# EAGLE design working (EAGLE 6.3)
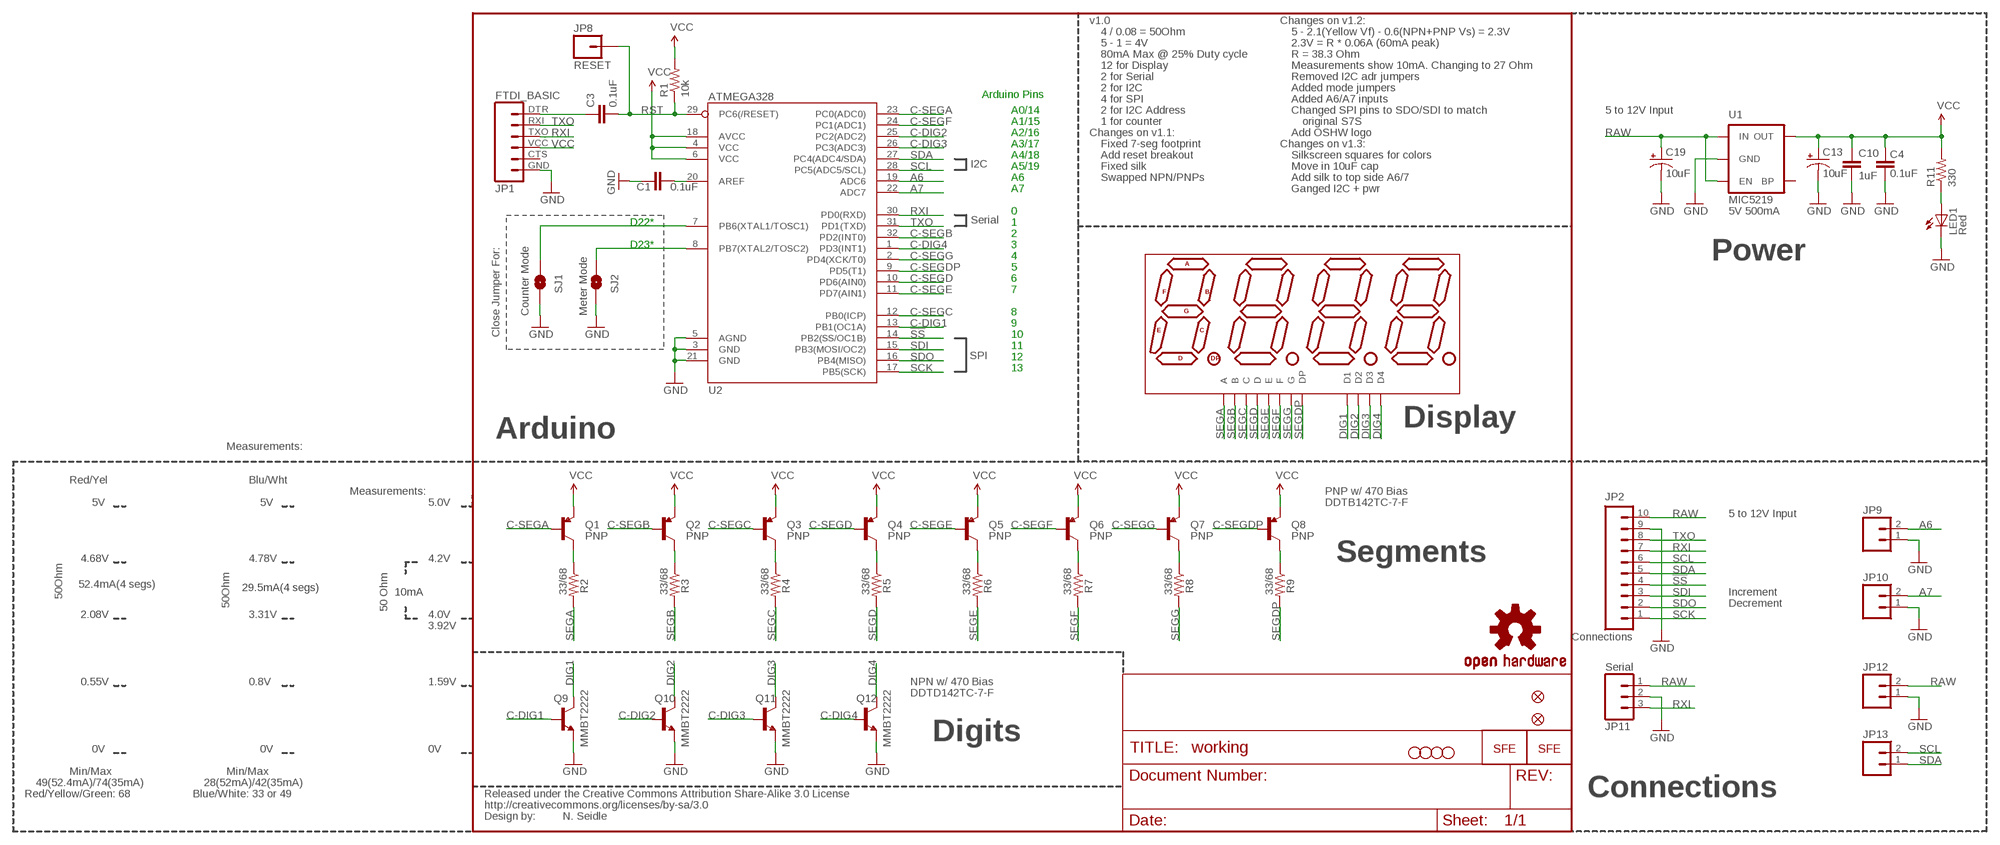
[diagram p0: schematic, sheet 1]

## Parts
C1  0.1uF  CAP0402-CAP  [0402-CAP]
C3  0.1uF  CAP0402-CAP  [0402-CAP]
C4  0.1uF  CAP0402-CAP  [0402-CAP]
C10  1uF  CAP0402-CAP  [0402-CAP]
C13  10uF  CAP_POL1206  [EIA3216]
C19  10uF  CAP_POL1206  [EIA3216]
JP1  FTDI_BASIC  FTDI_BASICPTH  [FTDI_BASIC]
JP2  Connections  M10"  [1X10]
JP3  STAND-OFF  [STAND-OFF]
JP4  STAND-OFF  [STAND-OFF]
JP5  STAND-OFF  [STAND-OFF]
JP6  STAND-OFF  [STAND-OFF]
JP7  FIDUCIALUFIDUCIAL  [MICRO-FIDUCIAL]
JP8  RESET  M01PTH  [1X01]
JP9  M02PTH  [1X02]
JP10  M02PTH  [1X02]
JP11  Serial  M03JST-PTH  [JST-3-PTH]
JP12  M02PTH  [1X02]
JP13  M02PTH  [1X02]
JP14  FIDUCIALUFIDUCIAL  [MICRO-FIDUCIAL]
LED1  Red  LED0603  [LED-0603]
Q1  PNP  TRANSISTOR_PNPSMD  [SOT23-3]
Q2  PNP  TRANSISTOR_PNPSMD  [SOT23-3]
Q3  PNP  TRANSISTOR_PNPSMD  [SOT23-3]
Q4  PNP  TRANSISTOR_PNPSMD  [SOT23-3]
Q5  PNP  TRANSISTOR_PNPSMD  [SOT23-3]
Q6  PNP  TRANSISTOR_PNPSMD  [SOT23-3]
Q7  PNP  TRANSISTOR_PNPSMD  [SOT23-3]
Q8  PNP  TRANSISTOR_PNPSMD  [SOT23-3]
Q9  MMBT2222  TRANSISTOR_NPNSOT23-3  [SOT23-3]
Q10  MMBT2222  TRANSISTOR_NPNSOT23-3  [SOT23-3]
Q11  MMBT2222  TRANSISTOR_NPNSOT23-3  [SOT23-3]
Q12  MMBT2222  TRANSISTOR_NPNSOT23-3  [SOT23-3]
R1  10k  RESISTOR0402-RES  [0402-RES]
R2  33/68  RESISTOR0402-RES  [0402-RES]
R3  33/68  RESISTOR0402-RES  [0402-RES]
R4  33/68  RESISTOR0402-RES  [0402-RES]
R5  33/68  RESISTOR0402-RES  [0402-RES]
R6  33/68  RESISTOR0402-RES  [0402-RES]
R7  33/68  RESISTOR0402-RES  [0402-RES]
R8  33/68  RESISTOR0402-RES  [0402-RES]
R9  33/68  RESISTOR0402-RES  [0402-RES]
R11  330  RESISTOR0402-RES  [0402-RES]
SJ1  Counter Ctl  SOLDERJUMPERNO  [SJ_2S-NO]
SJ2  Counter Ctl  SOLDERJUMPERNO  [SJ_2S-NO]
U1  MIC5219  V_REG_LDOSMD  [SOT23-5]
U2  ATMEGA328  ATMEGA168  [TQFP32-08]
U3  7-SEGMENT-4DIGIT-COUNTERPTH  [7-SEGMENT-4DIGIT-COUNTER]
U$2  LOGO-SFESK  [SFE-LOGO-FLAME]
U$3  CREATIVE_COMMONS  [CREATIVE_COMMONS]
U$4  OSHW-LOGOS  [OSHW-LOGO-S]
U$7  LOGO-SFENW2  [SFE-NEW-WEB]

## Nets
!SS: JP2.4 U2.14(PB2(SS/OC1B))
A6: JP9.2 U2.19(ADC6)
A7: JP10.2 U2.22(ADC7)
ANALOG: SJ2.1 U2.8(PB7(XTAL2/TOSC2))
C-DIG1: Q9.1(B) U2.13(PB1(OC1A))
C-DIG2: Q10.1(B) U2.25(PC2(ADC2))
C-DIG3: Q11.1(B) U2.26(PC3(ADC3))
C-DIG4: Q12.1(B) U2.1(PD3(INT1))
C-SEGA: Q1.1(B) U2.23(PC0(ADC0))
C-SEGB: Q2.1(B) U2.32(PD2(INT0))
C-SEGC: Q3.1(B) U2.12(PB0(ICP))
C-SEGD: Q4.1(B) U2.10(PD6(AIN0))
C-SEGDP: Q8.1(B) U2.9(PD5(T1))
C-SEGE: Q5.1(B) U2.11(PD7(AIN1))
C-SEGF: Q6.1(B) U2.24(PC1(ADC1))
C-SEGG: Q7.1(B) U2.2(PD4(XCK/T0))
COUNTER: SJ1.1 U2.7(PB6(XTAL1/TOSC1))
DIG1: Q9.3(C) U3.12(D1)
DIG2: Q10.3(C) U3.9(D2)
DIG3: Q11.3(C) U3.8(D3)
DIG4: Q12.3(C) U3.6(D4)
GND: C1.1 C4.1 C10.2 C13.C(-) C19.C(-) JP1.GND JP2.9 JP9.1 JP10.1 JP11.2 JP12.1 LED1.C Q9.2(E) Q10.2(E) Q11.2(E) Q12.2(E) SJ1.2 SJ2.2 U1.2(GND) U2.3(GND) U2.5(AGND) U2.21(GND)
N$1: Q1.3(C) R2.1
N$3: C3.1 JP1.DTR
N$4: Q2.3(C) R3.1
N$5: Q3.3(C) R4.1
N$6: Q4.3(C) R5.1
N$7: Q5.3(C) R6.1
N$8: Q6.3(C) R7.1
N$9: Q7.3(C) R8.1
N$10: Q8.3(C) R9.1
N$11: C1.2 U2.20(AREF)
N$38: LED1.A R11.1
RAW [vcc]: C19.A(+) JP2.10 JP11.1 JP12.2 U1.1(IN) U1.3(EN)
RST: C3.2 JP8.1 R1.1 U2.29(PC6(/RESET))
RXI: JP1.TXO JP2.7 JP11.3 U2.30(PD0(RXD))
SCK: JP2.1 U2.17(PB5(SCK))
SCL: JP2.6 JP13.2 U2.28(PC5(ADC5/SCL))
SDA: JP2.5 JP13.1 U2.27(PC4(ADC4/SDA))
SDI: JP2.3 U2.15(PB3(MOSI/OC2))
SDO: JP2.2 U2.16(PB4(MISO))
SEGA: R2.2 U3.11(A)
SEGB: R3.2 U3.7(B)
SEGC: R4.2 U3.4(C)
SEGD: R5.2 U3.2(D)
SEGDP: R9.2 U3.3(DP)
SEGE: R6.2 U3.1(E)
SEGF: R7.2 U3.10(F)
SEGG: R8.2 U3.5(G)
TXO: JP1.RXI JP2.8 U2.31(PD1(TXD))
VCC: C4.2 C10.1 C13.A(+) JP1.VCC Q1.2(E) Q2.2(E) Q3.2(E) Q4.2(E) Q5.2(E) Q6.2(E) Q7.2(E) Q8.2(E) R1.2 R11.2 U1.5(OUT) U2.4(VCC) U2.6(VCC) U2.18(AVCC)
Unconnected: JP1.CTS U1.4(BP)

## Notes on the sheet
- v1.0 | Changes on v1.2:
- 4 / 0.08 = 50Ohm | 5 - 2.1(Yellow Vf) - 0.6(NPN+PNP Vs) = 2.3V
- 5 - 1 = 4V | 2.3V = R * 0.06A (60mA peak)
- 80mA Max @ 25% Duty cycle | R = 38.3 Ohm
- 12 for Display | Measurements show 10mA. Changing to 27 Ohm
- 2 for Serial | Removed I2C adr jumpers
- 2 for I2C | Added mode jumpers
- Arduino Pins
- 4 for SPI | Added A6/A7 inputs
- A0/14 | 2 for I2C Address | Changed SPI pins to SDO/SDI to match | 5 to 12V Input
- A1/15 | 1 for counter | original S7S
- A2/16 | Changes on v1.1: | Add OSHW logo
- A3/17 | Fixed 7-seg footprint | Changes on v1.3:
- A4/18 | Add reset breakout | Silkscreen squares for colors
- I2C | A5/19 | Fixed silk | Move in 10uF cap
- A6 | Swapped NPN/PNPs | Add silk to top side A6/7
- A7 | Ganged I2C + pwr
- 0 | 5V 500mA
- D22* | Serial | 1
- 2
- D23* | 3
- 4 | Power
- 5
- 6
- 7
- Counter Mode | Meter Mode | 8
- 9
- Close Jumper For: | 10
- 11
- SPI | 12
- 13
- Display
- Arduino
- Measurements:
- Red/Yel | Blu/Wht
- Measurements: | PNP w/ 470 Bias
- 5V | 5V | 5.0V | DDTB142TC-7-F
- 5 to 12V Input
- 4.68V | 4.78V | 4.2V | Segments
- 52.4mA(4 segs)
- 29.5mA(4 segs)
- 10mA | Increment
- 50Ohm
- 50Ohm | Decrement
- 50 Ohm
- 2.08V | 3.31V | 4.0V
- 3.92V
- 0.55V | 0.8V | 1.59V | NPN w/ 470 Bias
- DDTD142TC-7-F
- Digits
- 0V | 0V | 0V
- Min/Max | Min/Max
- 49(52.4mA)/74(35mA) | 28(52mA)/42(35mA)
- Red/Yellow/Green: 68 | Blue/White: 33 or 49 | Connections
- N. Seidle

## Library data of the parts
C1 C3 C4 C10 = SparkFun:CAP: Capacitor Standard 0603 ceramic capacitor, and 0.1" leaded capacitor.
C13 C19 = SparkFun:CAP_POL: Capacitor Polarized These are standard SMD and PTH capacitors. Normally 10uF, 47uF, and 100uF in electrolytic and tantalum varieties. Always verify the external diameter of the through hole cap, it varies with capacity, voltage, and manufacturer. The EIA devices should be standard.
JP1 = SparkFun:FTDI_BASIC: FTDI Basic: 3.3V and 5V
JP2 = SparkFun-Connectors:M10: Header 10 Standard 10-pin 0.1" header. Use with straight break away headers (SKU : PRT-00116), right angle break away headers (PRT-00553), swiss pins (PRT-00743), machine pins (PRT-00117), and female headers (PRT-00115).
JP3-JP6 = SparkFun-Electromechanical:STAND-OFF: #4 Stand Off This is the mechanical footprint for a #4 phillips button head screw. Use the keepout ring to avoid running the screw head into surrounding components. SKU : PRT-00447
JP7 JP14 = SparkFun:FIDUCIAL: Fiducial Alignment Points Various fiducial points for machine vision alignment.
JP8 = SparkFun-Connectors:M01: Header 1 Standard 1-pin 0.1" header. Use with straight break away headers (SKU : PRT-00116), right angle break away headers (PRT-00553), swiss pins (PRT-00743), machine pins (PRT-00117), and female headers (PRT-00115).
JP9 JP10 JP12 JP13 = SparkFun-Connectors:M02: Header 2 Standard 2-pin 0.1" header. Use with straight break away headers (SKU : PRT-00116), right angle break away headers (PRT-00553), swiss pins (PRT-00743), machine pins (PRT-00117), and female headers (PRT-00115). Molex polarized connector foot print use with SKU : PRT-08233 with associated crimp pins and housings.
JP11 = SparkFun-Connectors:M03: Header 3 Standard 3-pin 0.1" header. Use with straight break away headers (SKU : PRT-00116), right angle break away headers (PRT-00553), swiss pins (PRT-00743), machine pins (PRT-00117), and female headers (PRT-00115). Molex polarized connector foot print use with SKU : PRT-08232 with associated crimp pins and housings.
LED1 = SparkFun:LED: LEDs Standard schematic elements and footprints for 5mm, 3mm, 1206, and 0603 sized LEDs. 5mm - Spark Fun Electronics SKU : COM-00529 (and others)
Q1-Q8 = SparkFun-DiscreteSemi:TRANSISTOR_PNP: Generic PNP BJT. Double check pinouts against datasheets- not all devices are the same!
Q9-Q12 = SparkFun-DiscreteSemi:TRANSISTOR_NPN: Generic NPN BJT. MMBT2222 is the common NPN we use. Double check against datasheet- not all devices are the same!
R1-R9 R11 = SparkFun:RESISTOR: Resistor Basic schematic elements and footprints for 0603, 1206, and PTH resistors.
SJ1 SJ2 = SparkFun-Passives:SOLDERJUMPER: Solder Jumper Standard SMD solder jumper. Used to automate production. Two varients : Normally Open and Normally Closed are the same, but have different paste layers. NC will have a large amount of paste and should jumper during reflow.
U1 = SparkFun:V_REG_LDO: Voltage Regulator LDO Standard 150mA LDO voltage regulator in SOT-23 layout. Micrel part MIC5205. BP (by-pass) pin is used to lower output noise with 470pF cap.
U2 = SparkFun-DigitalIC:ATMEGA168: Atmel 32-pin 8-bit micro, 16k flash.
U3 = SparkFun-Displays:7-SEGMENT-4DIGIT-COUNTER
U$2 U$7 = SparkFun:LOGO-SFE: Spark Fun Electronics PCB Logo This is the standard Spark Fun Electronics PCB logo.
U$3 = SparkFun:CREATIVE_COMMONS
U$4 = SparkFun-Aesthetics:OSHW-LOGO: Open Source Hardware Logo This logo indicates the piece of hardware it is found on incorporates a OSHW license and/or adheres to the definition of open source hardware found here: http://freedomdefined.org/OSHW

## Net classes
0 default: width 0.203 mm

## Board
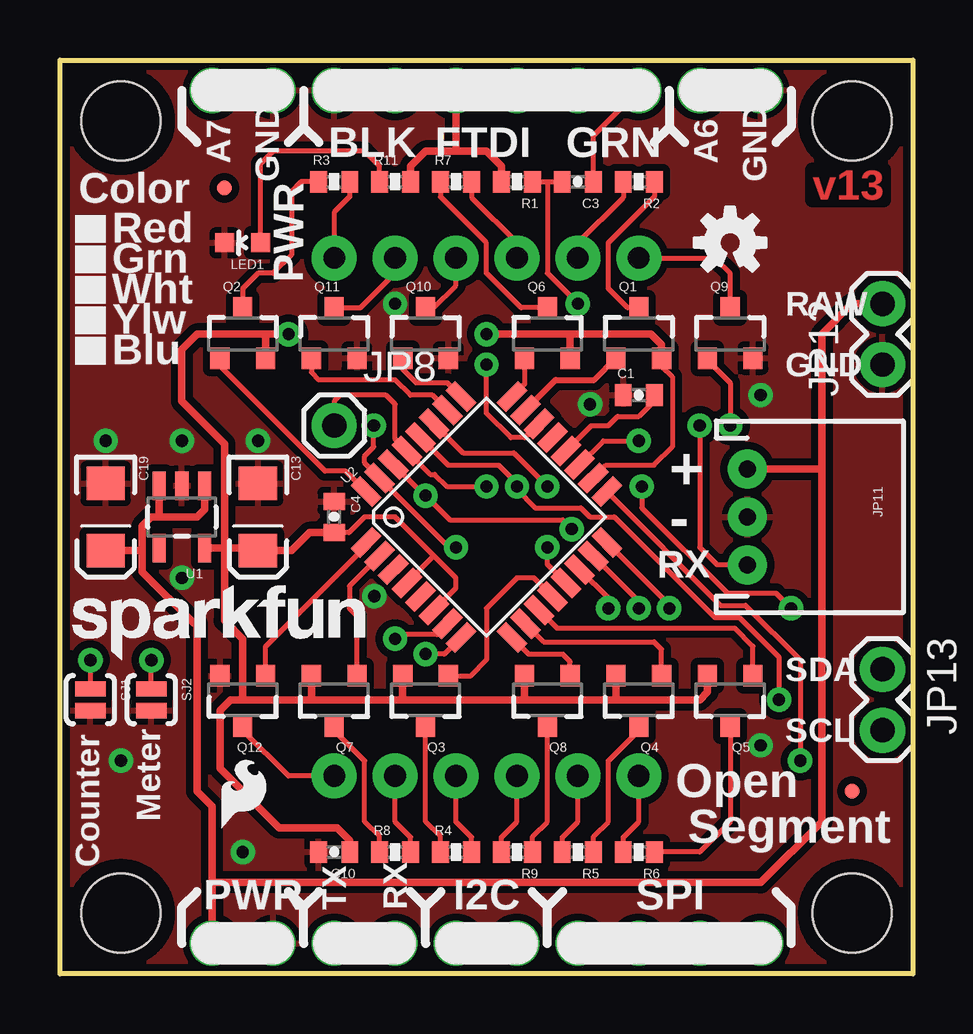
[diagram p1: board, top side]
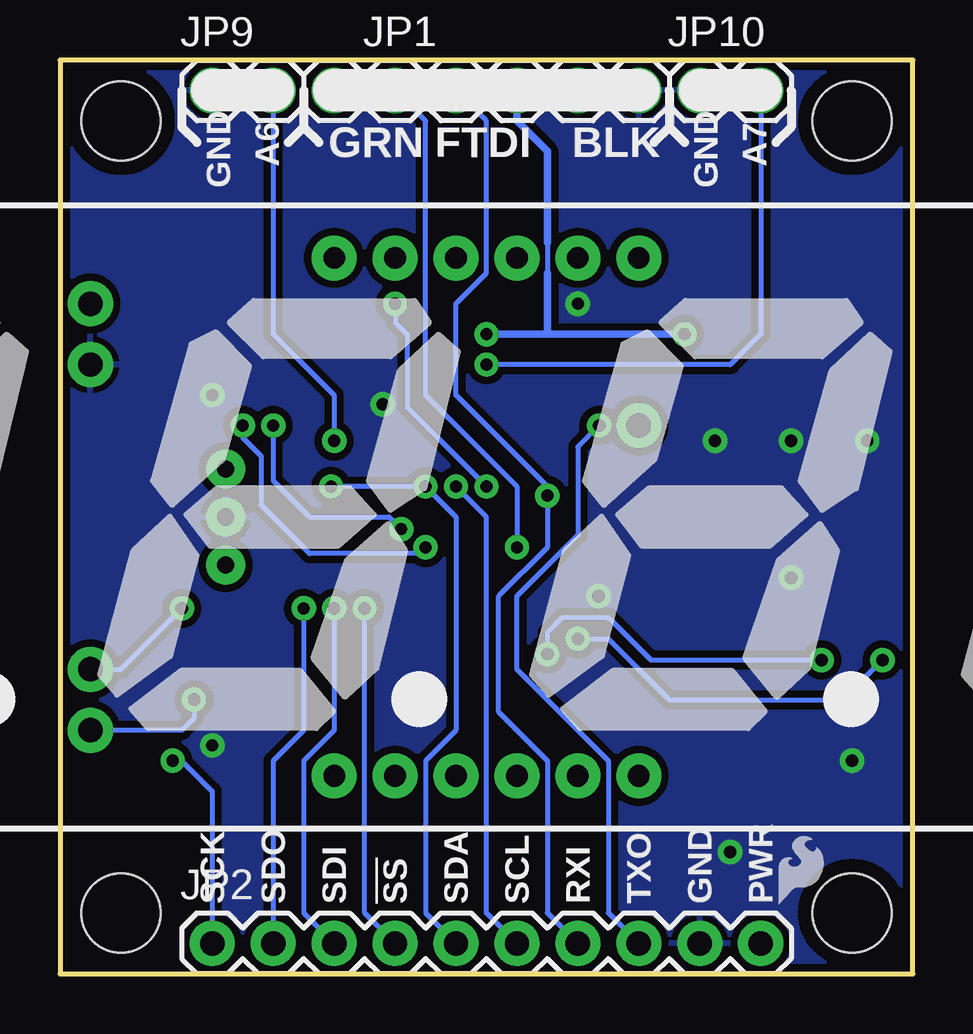
[diagram p2: board, bottom side, seen from below]

Size 35.56 x 38.1 mm. Coordinates in mm from the lower left corner, seen from the top.
Outline: 35.56,38.1 35.56,0 0,0 0,38.1 35.56,38.1
Copper layers (1*16): Top 0.035mm / dielectric 1.5mm / Bottom 0.035mm
Design rules "default": minimum track width 8mil, minimum drill 20mil, track to track 8mil, track to pad 8mil, pad to pad 8mil, via to via 8mil, smd to smd 8mil, copper to edge 10mil, drill to drill 8mil, minimum pad ring 12mil, minimum via ring 10mil, stop-mask expansion 4mil, vias tented up to drill 20mil, thermal gap 10mil

### Footprints (pad centres in the part's own frame; a part is rotated, then mirrored left to right if it is on the bottom)
0402-CAP = smd 0.7 x 0.9: 1 -0.65,0; 2 0.65,0
EIA3216 = smd 1.4 x 1.6: A 1.4,0; C -1.4,0
FTDI_BASIC = drill 1.016 pad 1.88: CTS 10.16,0; DTR 0,0; GND 12.7,0; RXI 2.54,0; TXO 5.08,0; VCC 7.62,0
1X10 = drill 1.016 pad 1.88: 1 0,0; 2 2.54,0; 3 5.08,0; 4 7.62,0; 5 10.16,0; 6 12.7,0; 7 15.24,0; 8 17.78,0; 9 20.32,0; 10 22.86,0
STAND-OFF = hole 3.302: 0,0
MICRO-FIDUCIAL = smd 0.635 x 0.635: 1 0,0
1X01 = drill 1.016 pad 1.88: 1 0,0
1X02 = drill 1.016 pad 1.88: 1 0,0; 2 2.54,0
JST-3-PTH = drill 0.7 pad 1.626: 1 -2,-5; 2 0,-5; 3 2,-5
LED-0603 = smd 0.8 x 0.8: A 0,-0.75; C 0,0.75
SOT23-3 = smd 0.8 x 0.9: 1 -0.95,-1; 2 0.95,-1; 3 0,1.1
0402-RES = smd 0.7 x 0.9: 1 -0.65,0; 2 0.65,0
SJ_2S-NO = smd 0.635 x 1.27: 1 -0.45,0; 2 0.45,0
SOT23-5 = smd 0.55 x 1.2: 1 -0.95,-1.3; 2 0,-1.3; 3 0.95,-1.3; 4 0.95,1.3; 5 -0.95,1.3
TQFP32-08 = smd 1.27 x 0.559: 1 -4.293,2.8; 2 -4.293,2; 3 -4.293,1.2; 4 -4.293,0.4; 5 -4.293,-0.4; 6 -4.293,-1.2; 7 -4.293,-2; 8 -4.293,-2.8; 17 4.293,-2.8; 18 4.293,-2; 19 4.293,-1.2; 20 4.293,-0.4; 21 4.293,0.4; 22 4.293,1.2; 23 4.293,2; 24 4.293,2.8 | smd 0.559 x 1.27: 9 -2.8,-4.293; 10 -2,-4.293; 11 -1.2,-4.293; 12 -0.4,-4.293; 13 0.4,-4.293; 14 1.2,-4.293; 15 2,-4.293; 16 2.8,-4.293; 25 2.8,4.293; 26 2,4.293; 27 1.2,4.293; 28 0.4,4.293; 29 -0.4,4.293; 30 -1.2,4.293; 31 -2,4.293; 32 -2.8,4.293
7-SEGMENT-4DIGIT-COUNTER = drill 0.9 pad 1.88: 1 -6.35,-10.795; 2 -3.81,-10.795; 3 -1.27,-10.795; 4 1.27,-10.795; 5 3.81,-10.795; 6 6.35,-10.795; 7 6.35,10.795; 8 3.81,10.795; 9 1.27,10.795; 10 -1.27,10.795; 11 -3.81,10.795; 12 -6.35,10.795

### Placement (x,y rotation side)
C1  24.13,24.13 0 top
C3  21.59,33.02 180 top
C4  11.43,19.05 270 top
C10  11.43,5.08 180 top
C13  8.26,19.05 270 top
C19  1.91,19.05 270 top
JP1  24.13,36.83 0 bottom
JP2  29.21,1.27 0 bottom
JP3  33.02,35.56 0 top
JP4  2.54,35.56 0 top
JP5  33.02,2.54 0 top
JP6  2.54,2.54 0 top
JP7  6.86,32.77 0 top
JP8  11.43,22.86 0 top
JP9  29.21,36.83 0 bottom
JP10  8.89,36.83 0 bottom
JP11  33.66,19.05 270 top
JP12  34.29,25.4 90 top
JP13  34.29,12.7 270 top
JP14  33.02,7.62 0 top
LED1  7.62,30.48 90 top
Q1  24.13,26.67 0 top
Q2  7.62,26.67 0 top
Q3  15.24,11.43 180 top
Q4  24.13,11.43 180 top
Q5  27.94,11.43 180 top
Q6  20.32,26.67 0 top
Q7  11.43,11.43 180 top
Q8  20.32,11.43 180 top
Q9  27.94,26.67 0 top
Q10  15.24,26.67 0 top
Q11  11.43,26.67 0 top
Q12  7.62,11.43 180 top
R1  19.05,33.02 180 top
R2  24.13,33.02 180 top
R3  11.43,33.02 0 top
R4  16.51,5.08 0 top
R5  21.59,5.08 180 top
R6  24.13,5.08 180 top
R7  16.51,33.02 0 top
R8  13.97,5.08 0 top
R9  19.05,5.08 180 top
R11  13.97,33.02 0 top
SJ1  1.27,11.43 270 top
SJ2  3.81,11.43 270 top
U1  5.08,19.05 180 top
U2  17.78,19.05 45 top
U3  17.78,19.05 0 bottom
U$1  LOGO-SFESK  [SFE-LOGO-FLAME]  5.59,2.92 0 bottom
U$2  6.73,6.1 0 top
U$3  -6.35,-12.7 0 top  (outside the outline)
U$4  27.94,30.48 0 top
U$7  0.51,13.08 0 top

### Tracks (layer width: path | path; a pad name or v marks a point on that pad's centre or on a via)
!SS  (via drill 0.51)
  Top 0.203: U2.14 22.86,15.67 v22.86,15.24
  Bottom 0.203: v22.86,15.24 22.86,2.54 JP2.4
A6  (via drill 0.51)
  Top 0.203: U2.19 22.65,22.23 v24.13,22.23
  Bottom 0.203: JP9.2 26.67,26.67 24.13,24.13 v24.13,22.23
A7  (via drill 0.51)
  Top 0.203: U2.22 19.39,22.35 18.8,22.35 17.78,23.37 v17.78,25.4
  Bottom 0.203: JP10.2 6.35,26.67 7.62,25.4 v17.78,25.4
ANALOG  (via drill 0.51)
  Top 0.203: SJ2.1 v3.81,13.08 | U2.8 16.03,13.34 v15.24,13.34
  Bottom 0.203: v3.81,13.08 10.92,13.08 12.7,14.86 14.61,14.86 15.24,14.22 v15.24,13.34
C-DIG1  (via drill 0.51)
  Top 0.203: U2.13 20.32,17.08 v20.32,17.78 | Q9.1 26.99,25.59 27.94,24.64 v27.94,22.86
  Bottom 0.203: v27.94,22.86 27.94,22.35 27.18,21.59 27.18,19.56 25.15,17.53 20.57,17.53 v20.32,17.78
C-DIG2
  Top 0.203: U2.25 16.15,24.64 14.86,24.64 14.29,25.21 Q10.1
C-DIG3
  Top 0.203: U2.26 15.53,24.13 14.61,24.13 13.97,24.77 10.8,24.77 10.48,25.08 Q11.1
C-DIG4
  Top 0.203: U2.1 12.77,17.84 8.89,13.97 8.57,13.65 Q12.1
C-SEGA
  Top 0.254: U2.23 20.67,24.77 22.28,24.77 Q1.1
C-SEGB
  Top 0.203: Q2.1 6.67,25.33 11.05,20.96 11.92,20.96 U2.32
C-SEGC
  Top 0.203: U2.12 19.75,16.51 19.05,16.51 17.78,15.24 17.78,13.08 17.13,12.43 Q3.1
C-SEGD
  Top 0.203: U2.10 20.16,13.84 24.77,13.84 25.08,13.53 Q4.1
C-SEGDP
  Top 0.203: U2.9 19.54,13.34 20.96,13.34 21.27,13.02 Q8.1
C-SEGE
  Top 0.203: U2.11 20.72,14.41 28.13,14.41 28.89,13.66 Q5.1
C-SEGF
  Top 0.203: U2.24 19.37,24.6 Q6.1
C-SEGG
  Top 0.203: U2.2 12.07,16.16 12.07,15.24 12.38,14.93 Q7.1
COUNTER  (via drill 0.51)
  Top 0.203: U2.7 15.71,14.15 14.15,14.15 v13.97,13.97 | v1.27,13.08 SJ1.1
  Bottom 0.203: v13.97,13.97 12.7,13.97 10.16,11.43 2.92,11.43 v1.27,13.08
DIG1
  Top 0.203: Q9.3 27.94,29.21 27.3,29.84 U3.12
DIG2
  Top 0.203: Q10.3 15.58,27.77 16.51,28.7 U3.9
DIG3
  Top 0.203: Q11.3 12.53,27.77 13.97,29.21 U3.8
DIG4
  Top 0.203: Q12.3 7.62,10.16 9.53,8.26 U3.6
GND  (via drill 0.51)
  other vias: 22.1,23.75 29.21,24.13 29.21,9.53 2.54,8.89 7.62,5.08 13.11,15.75 8.26,22.23 5.08,16.51 1.91,22.23 13.97,27.94 5.08,22.23
  pour Top (isolate 0.305): 0,0 0,38.1 35.56,38.1 35.56,0
  pour Bottom (isolate 0.305): 0,0 0,38.1 35.56,38.1 35.56,0
N$1
  Top 0.203: Q1.3 23.66,27.77 22.86,28.58 22.86,30.48 24.78,32.4 R2.1
N$3
  Top 0.203: C3.1 22.24,34.94 JP1.DTR
N$4
  Top 0.203: R3.1 10.03,33.02 9.65,32.64 9.65,29.97 8.89,29.21 8.26,29.21 7.62,28.58 Q2.3
N$5
  Top 0.203: R4.1 15.86,5.73 15.24,6.35 Q3.3
N$6
  Top 0.203: R5.1 22.24,5.73 22.86,6.35 22.86,8.89 24.13,10.16 Q4.3
N$7
  Top 0.203: Q5.3 27.94,6.35 26.67,5.08 R6.1
N$8
  Top 0.203: Q6.3 19.22,27.77 17.78,29.21 17.78,30.48 15.86,32.4 R7.1
N$9
  Top 0.203: R8.1 13.32,5.73 12.7,6.35 12.7,8.89 11.43,10.16 Q7.3
N$10
  Top 0.203: R9.1 19.7,5.73 20.32,6.35 Q8.3
N$11
  Top 0.203: U2.20 22.16,22.86 22.86,22.86 23.24,23.24 24.13,23.24 24.78,23.89 C1.2
N$38
  Top 0.203: R11.1 13.32,33.67 12.7,34.29 8.89,34.29 8.37,33.77 LED1.A
RAW
  Top 0.305: 6.35,3.81 6.35,6.99 5.72,7.62 5.72,14.61 5.59,14.61 3.43,16.76 3.43,17.65 | 31.75,21.08 31.75,26.67 33.02,27.94 JP12.2 | 31.75,21.08 31.75,6.35 29.21,3.81 6.35,3.81 | 6.35,3.81 JP2.10 | JP11.1 31.72,21.05 31.75,21.08 | 3.43,17.65 3.43,18.67 3.81,19.05 4.19,19.05 | C19.A 3.43,17.65 | 4.19,19.05 5.72,19.05 6.03,19.37 U1.1 | U1.3 4.13,19.11 4.19,19.05
RST  (via drill 0.51)
  Top 0.203: R1.1 20.32,33.02 | 20.32,33.02 C3.2 | 20.32,33.02 20.32,29.21 v21.59,27.94 | v17.78,20.32 16.13,20.32 15.62,20.83 15.44,20.83 U2.29 13.97,22.29 13.97,23.75 13.59,24.13 11.68,24.13 11.43,23.88 JP8.1
  Bottom 0.203: v17.78,20.32 21.08,23.62 21.08,26.67 21.59,27.18 v21.59,27.94
RXI  (via drill 0.51)
  Top 0.203: U2.30 15.19,19.94 v15.24,19.94 16.26,18.92 20.96,18.92 v21.34,18.54 | v26.67,22.86 26.67,17.78 27.4,17.05 JP11.3
  Bottom 0.203: JP2.7 15.24,2.54 15.24,8.89 17.27,10.92 17.27,15.75 15.24,17.78 v15.24,19.94 15.24,20.32 19.05,24.13 19.05,27.94 17.78,29.21 17.78,35.56 JP1.TXO | v26.67,22.86 26.67,20.57 25.15,19.05 21.84,19.05 v21.34,18.54
SCK  (via drill 0.51)
  Top 0.203: U2.17 27.53,15.37 28.58,15.37 30.86,13.08 v30.86,8.89
  Bottom 0.203: v30.86,8.89 30.48,8.89 29.21,7.62 JP2.1
SCL  (via drill 0.51)
  Top 0.203: U2.28 16.19,21.21 18.29,21.21 19.05,20.45 v19.05,20.32 19.05,20.19 19.81,19.43 21.72,19.43 22.1,19.05 23.11,19.05 27.3,14.86 28.32,14.86 29.97,13.21 v29.97,11.43
  Bottom 0.203: v19.05,20.32 17.78,19.05 17.78,2.54 JP2.6 | v29.97,11.43 29.97,10.67 30.48,10.16 JP13.2
SDA  (via drill 0.51)
  Top 0.203: U2.27 16.81,21.72 18.92,21.72 v20.32,20.32 | v24.26,20.32 24.26,19.43 27.81,15.88 29.84,15.88 v30.48,15.24
  Bottom 0.203: JP2.5 20.32,2.54 20.32,8.89 19.05,10.16 19.05,19.05 v20.32,20.32 v24.26,20.32 | JP13.1 33.02,12.7 v30.48,15.24
SDI  (via drill 0.51)
  Top 0.203: U2.15 24.13,15.53 v24.13,15.24
  Bottom 0.203: v24.13,15.24 24.13,10.16 25.4,8.89 25.4,2.54 JP2.3
SDO  (via drill 0.51)
  Top 0.203: U2.16 25.4,15.39 v25.4,15.24
  Bottom 0.203: v25.4,15.24 25.4,10.16 26.67,8.89 JP2.2
SEGA
  Top 0.203: U3.11 21.59,30.48 23.48,32.37 R2.2
SEGB
  Top 0.203: R3.2 12.08,32.4 11.43,31.75 U3.7
SEGC
  Top 0.203: R4.2 17.16,5.7 16.51,6.35 U3.4
SEGD
  Top 0.203: R5.2 20.94,5.7 21.59,6.35 U3.2
SEGDP
  Top 0.203: R9.2 18.4,5.7 19.05,6.35 U3.3
SEGE
  Top 0.203: R6.2 23.48,5.7 24.13,6.35 U3.1
SEGF
  Top 0.203: R7.2 17.16,32.37 19.05,30.48 U3.10
SEGG
  Top 0.203: R8.2 14.62,5.7 13.97,6.35 U3.5
TXO  (via drill 0.51)
  Top 0.203: v16.51,17.78 16.22,17.78 U2.31 12.7,21.3 12.7,21.59 13.08,21.97 v13.08,22.86
  Bottom 0.203: v16.51,17.78 16.51,20.32 20.32,24.13 20.32,35.56 JP1.RXI | v13.08,22.86 13.97,21.97 13.97,18.29 16.51,15.75 16.51,12.7 12.7,8.89 12.7,2.54 JP2.8
VCC  (via drill 0.51)
  Top 0.203: U2.4 15.56,17.39 15.56,17.46 | C4.2 12.05,18.4 12.7,19.05 13.97,19.05 15.56,17.46 | U2.6 16.51,16.08 16.51,16.51 15.56,17.46 | U2.18 22.77,21.21 24.77,21.21 25.53,21.97 25.53,24.89 25.08,25.34 Q1.2
  Top 0.305: 21.21,26.67 24.64,26.67 25.08,26.23 Q1.2 | R1.2 18.4,33.67 17.78,34.29 16.51,34.29 | R11.2 14.62,33.67 15.24,34.29 16.51,34.29 | 6.86,17.75 6.86,22.1 5.08,23.88 5.08,26.04 5.72,26.67 8.51,26.67 | U1.5 6.86,17.75 | 6.86,17.75 7.52,17.75 7.62,17.65 C13.A 9.65,17.65 10.4,18.4 C4.2 | C10.1 12.08,5.57 11.56,6.1 9.14,6.1 6.67,8.57 6.67,10.99 7.11,11.43 7.62,11.43 | 16.51,34.29 JP1.VCC | v9.53,26.67 8.51,26.67 | Q2.2 8.57,26.61 8.51,26.67 | Q6.2 21.27,26.61 21.21,26.67 | Q5.2 26.99,11.75 26.67,11.43 23.11,11.43 | 23.11,11.43 19.43,11.43 | 19.43,11.43 14.22,11.43 | 14.22,11.43 10.54,11.43 | 10.54,11.43 7.62,11.43 | Q7.2 10.48,11.49 10.54,11.43 | Q3.2 14.29,11.5 14.22,11.43 | Q8.2 19.37,11.49 19.43,11.43 | Q4.2 23.18,11.5 23.11,11.43 | 7.62,11.43 7.62,13.97 6.86,14.73 6.86,17.75 | v17.78,26.67 21.21,26.67
  Bottom 0.203: 15.24,30.48 15.24,29.21
  Bottom 0.305: JP1.VCC 16.51,35.56 15.24,34.29 15.24,30.48 | v17.78,26.67 15.24,26.67 | 15.24,26.67 v9.53,26.67 | 15.24,29.21 15.24,26.67

### Text on the board
Top: v13
tPlace: A7 | BLK | FTDI | GRN | A6 | GND | GND | Color | Red | Grn | PWR | Wht | Ylw | RAW | Blu | GND | + | - | RX | SDA | SCL | Open | Meter | Segment | Counter | PWR | TX | RX | I2C | SPI | N. Seidle
bPlace: A7 | BLK | FTDI | GRN | A6 | GND | GND | PWR | GND | TXO | RXI | SCL | SDA | !SS | SDI | SDO | SCK
Measures: 1.20 | 0.15 | 1.30 | 1.50 | 1.0236 | 0.7173 | All dimensions are in inches. | 1.40